# Altium schematic sheet Main_Board.SchDoc
size A3; SheetNumber: 1; SheetTotal: 4
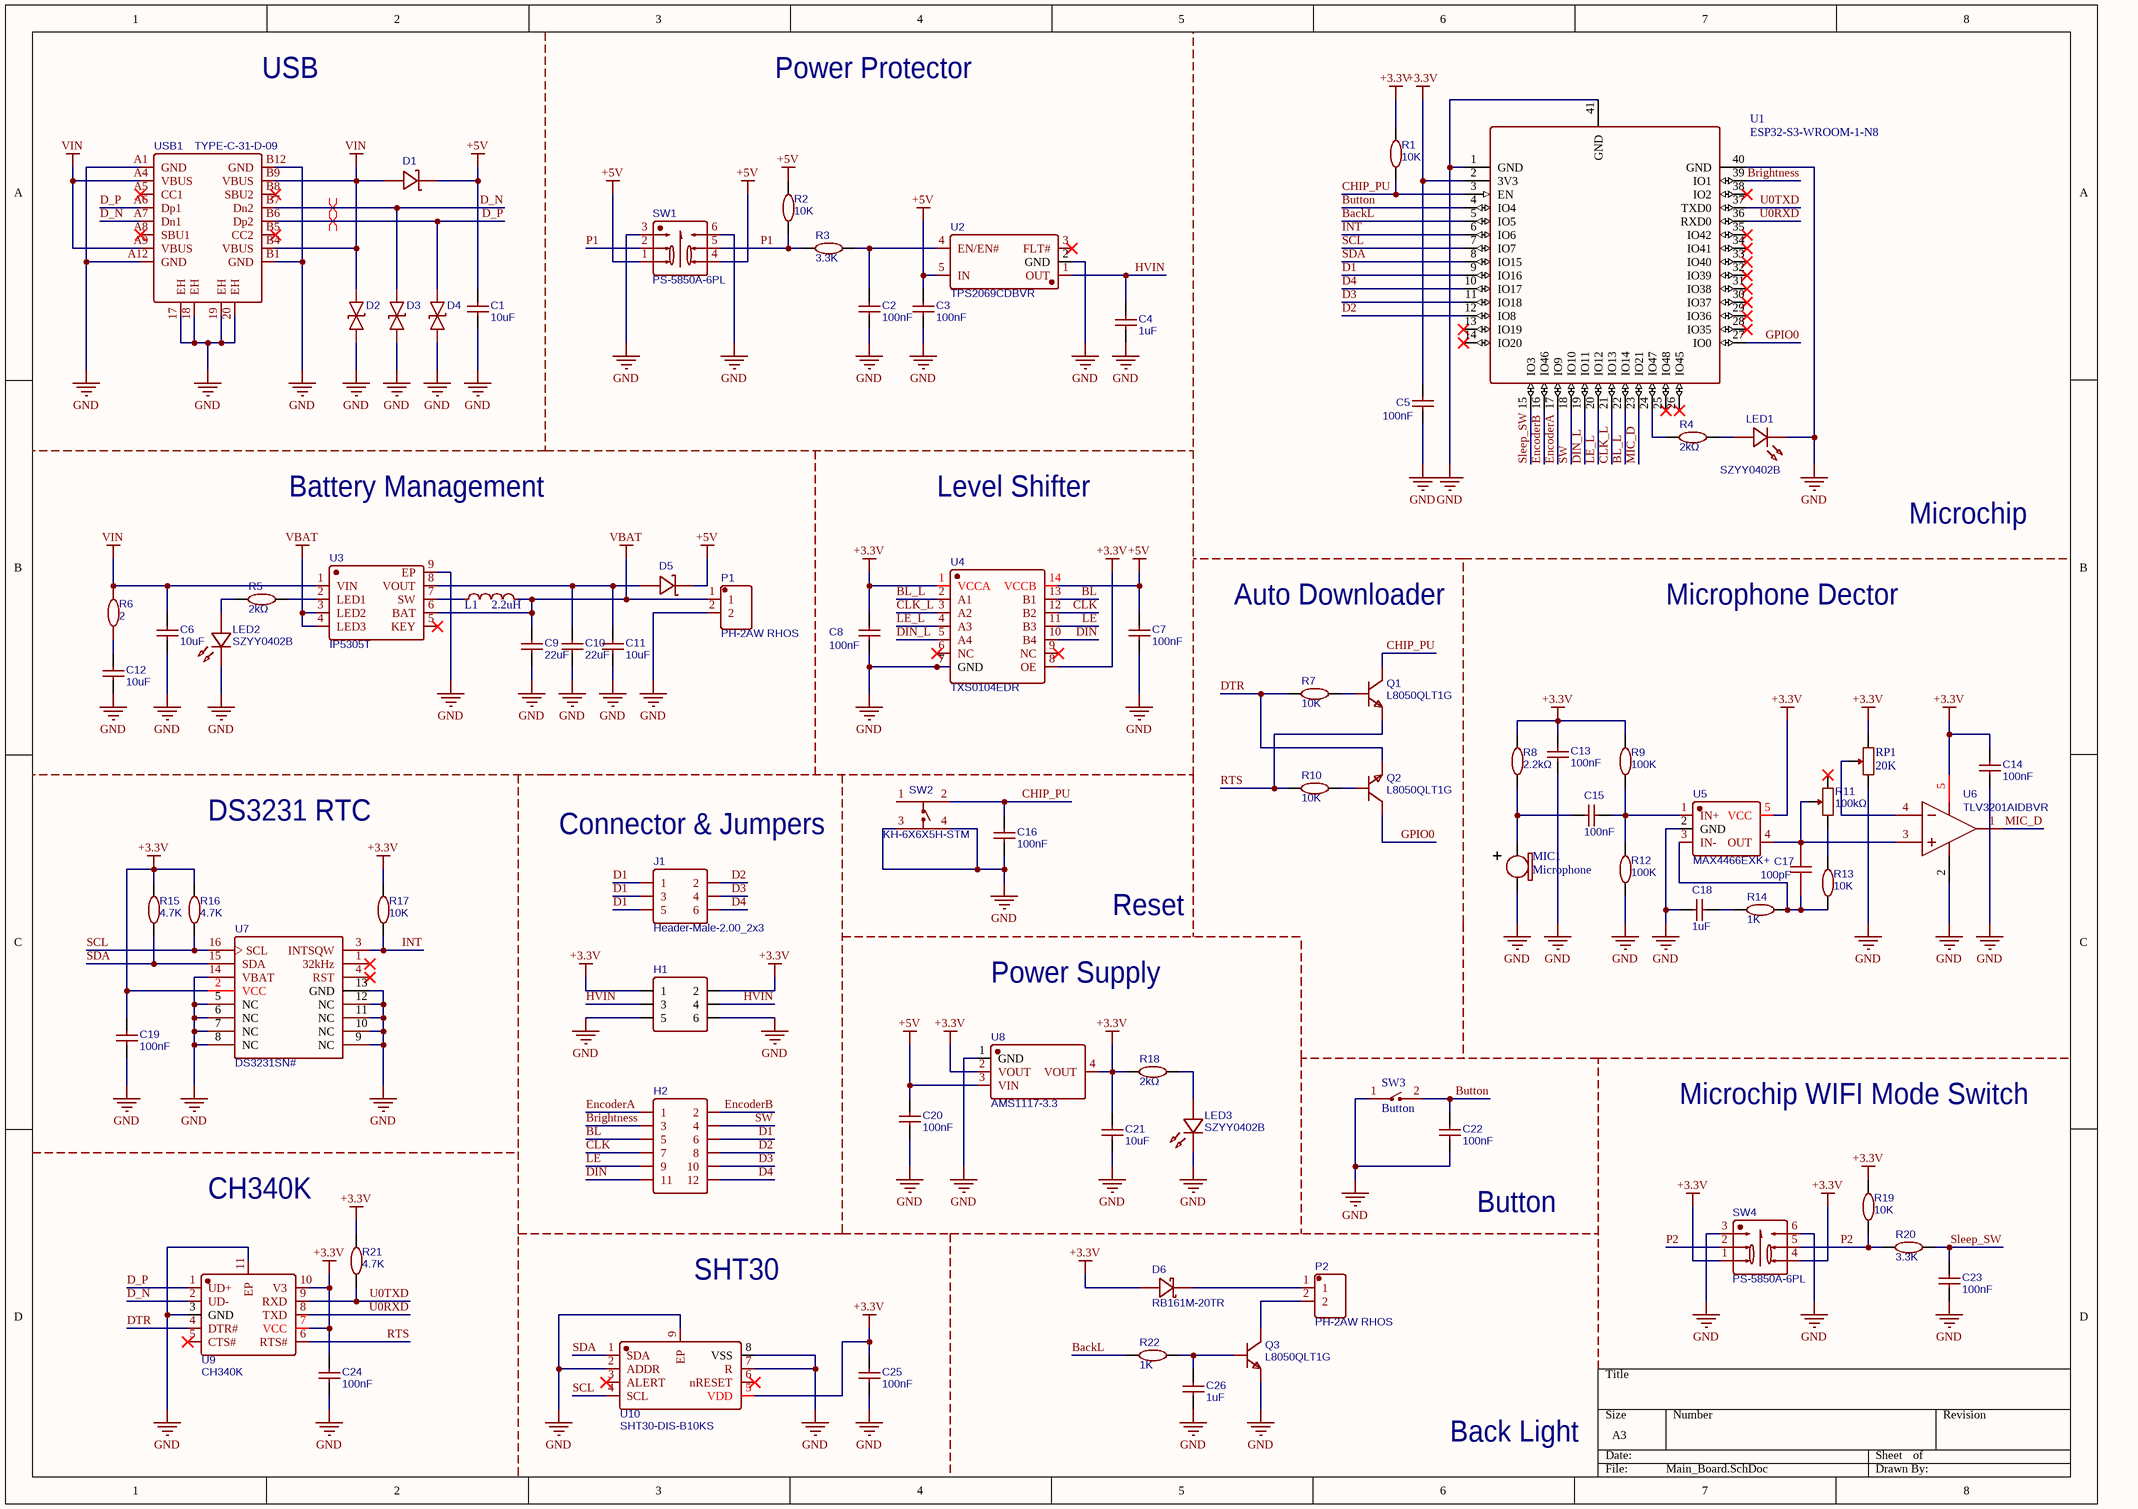
[diagram p0: Main_Board.SchDoc]

## Parts
C1  10uF  [C0805]
C2  100nF  [C0402_NEW]
C3  100nF  [C0402_NEW]
C4  1uF  [C0402]
C5  100nF  [C0402_NEW]
C6  10uF  [C0805]
C7  100nF  [C0402_NEW]
C8  100nF  [C0402_NEW]
C9  22uF  [C0805]
C10  22uF  [C0805]
C11  10uF  [C0805]
C12  10uF  [C0805]
C13  100nF  [C0402_NEW]
C14  100nF  [C0402_NEW]
C15  100nF  [C0402_NEW]
C16  100nF  [C0402_NEW]
C17  100pF  [C0402]
C18  1uF  [C0402]
C19  100nF  [C0402_NEW]
C20  100nF  [C0402_NEW]
C21  10uF  [C0805]
C22  100nF  [C0402_NEW]
C23  100nF  [C0402_NEW]
C24  100nF  [C0402_NEW]
C25  100nF  [C0402_NEW]
C26  1uF  [C0402]
D1  SS54_C22452  [SMA_L4.4-W2.8-LS5.4-R-RD]  (value not drawn)
D2  LESD5D5.0CT1G  [SOD-523_L1.2-W0.8-LS1.6-BI]  (value not drawn)
D3  LESD5D5.0CT1G  [SOD-523_L1.2-W0.8-LS1.6-BI]  (value not drawn)
D4  LESD5D5.0CT1G  [SOD-523_L1.2-W0.8-LS1.6-BI]  (value not drawn)
D5  SS54_C22452  [SMA_L4.4-W2.8-LS5.4-R-RD]  (value not drawn)
D6  RB161M-20TR  [SOD-123_L2.6-W1.6-LS3.5-RD-1]
H1  Header-Female-2.54_2x3  [HDR-TH_6P-P2.54-V-F-R2-C3-S2.54]  (value not drawn)
H2  Header-Female-2.54_2x6  [HDR-TH_12P-P2.54-V-F-R2-C6-S2.54]  (value not drawn)
J1  Header-Male-2.00_2x3  [HDR2.0-LI-2X3P]
L1  2.2uH  [L_2.2uH]
LED1  SZYY0402B  [LED0402-RD_BLUE]
LED2  SZYY0402B  [LED0402-RD_BLUE]
LED3  SZYY0402B  [LED0402-RD_BLUE]
MIC1  Microphone  [Microphone]
P1  PH-2AW RHOS  [CONN-TH_2P-P2.00_PH-2AW]
P2  PH-2AW RHOS  [CONN-TH_2P-P2.00_PH-2AW]
Q1  L8050QLT1G  [SOT-23-3_L2.9-W1.3-P1.90-LS2.4-BR]
Q2  L8050QLT1G  [SOT-23-3_L2.9-W1.3-P1.90-LS2.4-BR]
Q3  L8050QLT1G  [SOT-23-3_L2.9-W1.3-P1.90-LS2.4-BR]
R1  10K  [R0402]
R2  10K  [R0402]
R3  3.3K  [R0402]
R4  2kΩ  [R0402]
R5  2kΩ  [R0402]
R6  2  [R0603]
R7  10K  [R0402]
R8  2.2kΩ  [R0402]
R9  100K  [R0402]
R10  10K  [R0402]
R11  100kΩ  [RES-ADJ-SMD_VG039NCH]
R12  100K  [R0402]
R13  10K  [R0402]
R14  1K  [R0402]
R15  4.7K  [R0402]
R16  4.7K  [R0402]
R17  10K  [R0402]
R18  2kΩ  [R0402]
R19  10K  [R0402]
R20  3.3K  [R0402]
R21  4.7K  [R0402]
R22  1K  [R0402]
RP1  20K  [RES-ADJ-SMD_VG039NCH]
SW1  PS-5850A-6PL  [SW-TH_6P-L5.8-W5.8-P2.00-LS4.5-BL]
SW2  KH-6X6X5H-STM  [SW-SMD_4P-L6.0-W6.0-P4.50-LS9.0-2]
SW3  Button  [Button]
SW4  PS-5850A-6PL  [SW-TH_6P-L5.8-W5.8-P2.00-LS4.5-BL]
U1  ESP32-S3-WROOM-1-N8  [ESP32-S3-WROOM-1-N8_EXP]
U2  TPS2069CDBVR  [SOT-23-5_L3.0-W1.7-P0.95-LS2.8-BR]
U3  IP5305T  [ESOP-8_L4.9-W3.9-P1.27-LS6.0-BL-EP]
U4  TXS0104EDR  [SOIC-14_L8.7-W3.9-P1.27-LS6.0-BL]
U5  MAX4466EXK+  [SC-70-5_L2.0-W1.3-P0.65-LS2.2-BL]
U6  TLV3201AIDBVR  [SOT-23-5_L3.0-W1.7-P0.95-LS2.8-BR]
U7  DS3231SN#  [SOIC-16_L10.3-W7.5-P1.27-LS10.3-BL]
U8  AMS1117-3.3  [SOT-223-3_L6.5-W3.4-P2.30-LS7.0-BR]
U9  CH340K  [ESOP-10_L4.9-W3.9-P1.00-LS6.2-BL-EP]
U10  SHT30-DIS-B10KS  [DFN-8_L2.5-W2.5-P0.50-BL-EP]
USB1  TYPE-C-31-D-09  [USB-C-TH_TYPE-C-31-D-09]

## Nets
+3.3V: C5.2 C8.2 C13.2 C14.2 C19.2 C21.2 C24.2 C25.2 D6.2(A) H1.1 H1.2 R1.2 R8.2 R9.2 R15.2 R16.2 R17.2 R18.1 R19.2 R21.2 RP1.1 SW4.1 SW4.4 U1.2(3V3) U4.1(VCCA) U4.8(OE) U5.5(VCC) U6.5(VCC) U7.2(VCC) U8.2(VOUT) U8.4(VOUT) U9.7(VCC) U9.10(V3) U10.5(VDD)
+5V: C1.2 C3.2 C7.2 C20.2 D1.2(K) D5.2(K) R2.2 SW1.1 SW1.4 U2.5(IN) U4.14(VCCB) U8.3(VIN)
GND: C1.1 C2.1 C3.1 C4.1 C5.1 C6.1 C7.1 C8.1 C9.1 C10.1 C11.1 C12.1 C13.1 C14.1 C16.1 C18.1 C19.1 C20.1 C21.1 C22.1 C23.1 C24.1 C25.1 C26.1 D2.1 D3.1 D4.1 H1.5 H1.6 LED1.1(K) LED2.1(K) LED3.1(K) MIC1.2 P1.2 Q3.2(E) R12.1 RP1.3 SW1.3 SW1.6 SW2.3 SW2.4 SW3.1 SW4.3 SW4.6 U1.1(GND) U1.40(GND) U1.41(GND) U2.2(GND) U3.9(EP) U4.7(GND) U5.2(GND) U6.2(GND) U7.5(NC) U7.6(NC) U7.7(NC) U7.8(NC) U7.9(NC) U7.10(NC) U7.11(NC) U7.12(NC) U7.13(GND) U7.14(VBAT) U8.1(GND) U9.3(GND) U9.11(EP) U10.2(ADDR) U10.7(R) U10.8(VSS) U10.9(EP) USB1.17(EH) USB1.18(EH) USB1.19(EH) USB1.20(EH) USB1.A1(GND) USB1.A12(GND) USB1.B1(GND) USB1.B12(GND)
VBAT: C9.2 L1.2 P1.1 U3.3(LED2) U3.4(LED3) U3.6(BAT)
VIN: C6.2 D1.1(A) D2.2 R6.2 U3.1(VIN) USB1.A4(VBUS) USB1.A9(VBUS) USB1.B4(VBUS) USB1.B9(VBUS)
BackL: R22.1 U1.5(IO5)
BL: H2.5 U4.13(B1)
BL_L: U1.22(IO14) U4.2(A1)
Brightness: H2.3 U1.39(IO1)
Button: C22.2 SW3.2 U1.4(IO4)
CHIP_PU: C16.2 Q1.3(C) R1.1 SW2.2 U1.3(EN)
CLK: H2.7 U4.12(B2)
CLK_L: U1.21(IO13) U4.3(A2)
D1: H2.6 J1.1 J1.3 J1.5 U1.9(IO16)
D2: H2.8 J1.2 U1.12(IO8)
D3: H2.10 J1.4 U1.11(IO18)
D4: H2.12 J1.6 U1.10(IO17)
D_N: D3.2 U9.2(UD-) USB1.A7(Dn1) USB1.B7(Dn2)
D_P: D4.2 U9.1(UD+) USB1.A6(Dp1) USB1.B6(Dp2)
DIN: H2.11 U4.10(B4)
DIN_L: U1.19(IO11) U4.5(A4)
DTR: Q2.2(E) R7.1 U9.4(DTR#)
EncoderA: H2.1 U1.17(IO9)
EncoderB: H2.2 U1.16(IO46)
GPIO0: Q2.3(C) U1.27(IO0)
HVIN: C4.2 H1.3 H1.4 U2.1(OUT)
INT: R17.1 U1.6(IO6) U7.3(INTSQW)
LE: H2.9 U4.11(B3)
LE_L: U1.20(IO12) U4.4(A3)
MIC_D: U1.23(IO21) U6.1(OUT)
P1: R2.1 R3.2 SW1.2 SW1.5
P2: R19.1 R20.2 SW4.2 SW4.5
RTS: Q1.2(E) R10.1 U9.6(RTS#)
SCL: R16.1 U1.7(IO7) U7.16(SCL) U10.4(SCL)
SDA: R15.1 U1.8(IO15) U7.15(SDA) U10.1(SDA)
Sleep_SW: C23.2 R20.1 U1.15(IO3)
SW: H2.4 U1.18(IO10)
U0RXD: U1.36(RXD0) U9.8(TXD)
U0TXD: R21.1 U1.37(TXD0) U9.9(RXD)
NetC2_2: C2.2 R3.1 U2.4(EN/EN#)
NetC10_2: C10.2 C11.2 D5.1(A) U3.8(VOUT)
NetC12_2: C12.2 R6.1
NetC15_1: C15.1 R9.1 R12.2 U5.1(IN+)
NetC15_2: C15.2 MIC1.1 R8.1
NetC17_1: C17.1 R11.2 U5.4(OUT) U6.3(IN+)
NetC17_2: C17.2 R13.1 R14.2 U5.3(IN-)
NetC18_2: C18.2 R14.1
NetC26_2: C26.2 Q3.1(B) R22.2
NetD6_1: D6.1(K) P2.1
NetL1_1: L1.1 U3.7(SW)
NetLED1_2: LED1.2(A) R4.2
NetLED2_2: LED2.2(A) R5.1
NetLED3_2: LED3.2(A) R18.2
NetP2_2: P2.2 Q3.3(C)
NetQ1_1: Q1.1(B) R7.2
NetQ2_1: Q2.1(B) R10.2
NetR4_1: R4.1 U1.24(IO47)
NetR5_2: R5.2 U3.2(LED1)
NetR11_3: R11.3 R13.2
NetRP1_2: RP1.2 U6.4(IN-)

Not connected (* = marked no-connect by the designer): R11 1*; SW2 1; U1 13(IO19)* 14(IO20)* 25(IO48)* 26(IO45)* 28(IO35)* 29(IO36)* 30(IO37)* 31(IO38)* 32(IO39)* 33(IO40)* 34(IO41)* 35(IO42)* 38(IO2)*; U2 3(FLT#)*; U3 5(KEY)*; U4 6(NC)* 9(NC)*; U7 1(32kHz)* 4(RST)*; U9 5(CTS#)*; U10 3(ALERT)* 6(nRESET)*; USB1 A5(CC1)* A8(SBU1)* B5(CC2)* B8(SBU2)*

## Layout directives
differential pair: D_N, D_P

## Notes on the sheet
- USB
- Power Protector
- Battery Management
- Level Shifter
- Microchip
- Auto Downloader
- Microphone Dector
- DS3231 RTC
- Connector & Jumpers
- Reset
- Power Supply
- Microchip WIFI Mode Switch
- CH340K
- Button
- SHT30
- Back Light

## Library data of the parts
C1 C6 C11 C12 C21 = 10uF: BOM_Manufacturer Part: CL21A106KOQNNNE; BOM_Manufacturer: SAMSUNG(三星); nameAlias: Capacitance; BOM_Supplier: LCSC; BOM_Supplier Part: C1713; BOM_JLCPCB Part Class: Extended Part; spicePre: C; spiceSymbolName: CL21A106KOQNNNE
C2 C3 C5 C7 C8 C13-C16 C19 C20 C22-C25 = 100nF: BOM_Manufacturer Part: CL05B104KO5NNNC; BOM_Manufacturer: SAMSUNG(三星); nameAlias: Capacitance; BOM_Supplier: LCSC; BOM_Supplier Part: C1525; BOM_JLCPCB Part Class: Basic Part; spicePre: C; spiceSymbolName: CL05B104KO5NNNC
C4 C18 C26 = 1uF: BOM_Manufacturer Part: CL05A105KO5NNNC; BOM_Manufacturer: SAMSUNG(三星); nameAlias: Capacitance; BOM_Supplier: LCSC; BOM_Supplier Part: C29266; BOM_JLCPCB Part Class: Extended Part; spicePre: C; spiceSymbolName: CL05A105KO5NNNC
C9 C10 = 22uF: BOM_Manufacturer: SAMSUNG(三星); BOM_Manufacturer Part: CL21A226MOQNNNE; nameAlias: Capacitance; BOM_Supplier: LCSC; BOM_Supplier Part: C98190; BOM_JLCPCB Part Class: Extended Part; spicePre: C; spiceSymbolName: CL21A226MOQNNNE
C17 = 100pF: BOM_Manufacturer: YAGEO(国巨); BOM_Manufacturer Part: CC0402JRNPO9BN101; nameAlias: Capacitance; BOM_Supplier: LCSC; BOM_Supplier Part: C106200; BOM_JLCPCB Part Class: Extended Part; spicePre: C; spiceSymbolName: CC0603JRNPO9BN101
D1 D5 = SS54_C22452: BOM_Manufacturer Part: SS54; BOM_Manufacturer: MDD; BOM_Supplier: LCSC; BOM_Supplier Part: C22452; BOM_JLCPCB Part Class: Basic Part; spicePre: D; spiceSymbolName: SS54_C22452
D2-D4 = LESD5D5.0CT1G: BOM_Manufacturer: LRC(乐山无线电); Contributor: LCSC; BOM_Supplier: LCSC; BOM_Supplier Part: C383211; BOM_Manufacturer Part: LESD5D5.0CT1G; BOM_JLCPCB Part Class: Extended Part; spicePre: D; spiceSymbolName: LESD5D5.0CT1G
D6 = RB161M-20TR: BOM_Manufacturer: ROHM(罗姆); Contributor: LCSC; BOM_Supplier: LCSC; BOM_Supplier Part: C427072; BOM_Manufacturer Part: RB161M-20TR; BOM_JLCPCB Part Class: Extended Part; spicePre: D; spiceSymbolName: RB161M-20TR
H1 = Header-Female-2.54_2x3: BOM_Manufacturer: CONNFLY; BOM_Manufacturer Part: DS1023-2*3SF11; Contributor: LCSC; BOM_Supplier: LCSC; BOM_Supplier Part: C92272; BOM_JLCPCB Part Class: Extended Part; spicePre: H; spiceSymbolName: Header-Female-2.54_2x3
H2 = Header-Female-2.54_2x6: BOM_Manufacturer: BOOMELE(博穆精密); BOM_Manufacturer Part: 2.54-2*6P母; BOM_Supplier: LCSC; BOM_Supplier Part: C36191; BOM_JLCPCB Part Class: Extended Part; spicePre: H; spiceSymbolName: Header-Female-2.54_2x6
LED1-LED3 = SZYY0402B: BOM_Manufacturer: yongyu(永裕光电); Contributor: LCSC; BOM_Supplier: LCSC; BOM_Supplier Part: C434447; BOM_Manufacturer Part: SZYY0402B; BOM_JLCPCB Part Class: Extended Part; spicePre: L; spiceSymbolName: SZYY0402B
P1 P2 = PH-2AW RHOS: BOM_Manufacturer: BOOMELE; spicePre: X; BOM_Supplier: LCSC; BOM_Manufacturer Part: PH-2AW RHOS; BOM_Supplier Part: C16965; BOM_JLCPCB Part Class: Extended Part; spiceSymbolName: PH-2AW RHOS
Q1-Q3 = L8050QLT1G: BOM_Manufacturer: LRC(乐山无线电); BOM_Supplier: LCSC; BOM_Manufacturer Part: L8050QLT1G; BOM_Supplier Part: C49581; BOM_JLCPCB Part Class: Extended Part; spicePre: Q; spiceSymbolName: L8050QLT1G
R1 R2 R7 R10 R13 R17 R19 = 10K: BOM_Manufacturer: YAGEO(国巨); BOM_Manufacturer Part: RC0402FR-0710KL; nameAlias: Resistance (Ohms); Resistance: 10kΩ; BOM_Supplier: LCSC; BOM_Supplier Part: C60490; BOM_JLCPCB Part Class: Extended Part; spicePre: R; spiceSymbolName: RC0402FR-0710KL
R3 R20 = 3.3K: BOM_Manufacturer: YAGEO(国巨); BOM_Manufacturer Part: RC0402FR-073K3L; nameAlias: Resistance (Ohms); Resistance: 3.3kΩ; BOM_Supplier: LCSC; BOM_Supplier Part: C137992; BOM_JLCPCB Part Class: Extended Part; spicePre: R; spiceSymbolName: RC0402FR-073K3L
R4 R5 R8 R18 = 2kΩ: BOM_Manufacturer Part: 0402WGF2001TCE; BOM_Manufacturer: UNI-ROYAL(厚声); nameAlias: Resistance; Resistance (Ohms): 2K; BOM_Supplier: LCSC; BOM_Supplier Part: C4109; BOM_JLCPCB Part Class: Basic Part; spicePre: R; spiceSymbolName: 0402WGF2001TCE
R6 = 2: BOM_Manufacturer: YAGEO(国巨); BOM_Manufacturer Part: RC0603FR-072RL; nameAlias: Resistance (Ohms); Contributor: LCSC; Resistance: 2Ω; BOM_Supplier: LCSC; BOM_Supplier Part: C185341; BOM_JLCPCB Part Class: Extended Part; spicePre: R; spiceSymbolName: RC0603FR-072RL
R9 R12 = 100K: BOM_Manufacturer: YAGEO(国巨); BOM_Manufacturer Part: RC0402FR-07100KL; nameAlias: Resistance (Ohms); Resistance: 100kΩ; BOM_Supplier: LCSC; BOM_Supplier Part: C60491; BOM_JLCPCB Part Class: Extended Part; spicePre: R; spiceSymbolName: RC0402FR-07100KL
R11 = RP-VG039NCHXTB104: BOM_Manufacturer: HDK(北陆电气); nameAlias: Resistance; Contributor: LCSC; Resistance(Ohms): 100K; BOM_Supplier: LCSC; BOM_Manufacturer Part: VG039NCHXTB104; BOM_Supplier Part: C128545; Resistance (Ohms): 100K; BOM_JLCPCB Part Class: Extended Part; spicePre: R; spiceSymbolName: VG039NCHXTB104
R14 R22 = 1K: BOM_Manufacturer: YAGEO(国巨); BOM_Manufacturer Part: RC0402FR-071KL; nameAlias: Resistance (Ohms); Resistance: 1kΩ; BOM_Supplier: LCSC; BOM_Supplier Part: C106235; BOM_JLCPCB Part Class: Extended Part; spicePre: R; spiceSymbolName: RC0402FR-071KL
R15 R16 R21 = 4.7K: BOM_Manufacturer: YAGEO(国巨); BOM_Manufacturer Part: RC0402FR-074K7L; nameAlias: Resistance (Ohms); Resistance: 4.7kΩ; BOM_Supplier: LCSC; BOM_Supplier Part: C105871; BOM_JLCPCB Part Class: Extended Part; spicePre: R; spiceSymbolName: RC0402FR-074K7L
RP1 = RP-VG039NCHXTB203: BOM名称: 插件电位器; 版权归属: 源创客; 学习资源: www.ooocke.com
SW1 SW4 = PS-5850A-6PL: BOM_Manufacturer: G-Switch; Contributor: LCSC; BOM_Supplier: LCSC; BOM_Supplier Part: C963201; BOM_Manufacturer Part: PS-5850A-6PL; BOM_JLCPCB Part Class: Extended Part; spicePre: S; spiceSymbolName: PS-5850A-6PL
SW2 = KH-6X6X5H-STM: BOM_Manufacturer: kinghelm(金航标); Contributor: LCSC; BOM_Supplier: LCSC; BOM_Supplier Part: C2837531; BOM_Manufacturer Part: KH-6X6X5H-STM; BOM_JLCPCB Part Class: Extended Part; spicePre: S; spiceSymbolName: KH-6X6X5H-STM
U1 = ESP32-S3-WROOM-1-N8: Mfr_Name: Espressif Systems; Copyright: Copyright (C) 2023 Ultra Librarian. All rights reserved.; Manufacturer_Part_Number: ESP32-S3-WROOM-1-N8; RefDes: RefDes; Type: DEV
U2 = TPS2069CDBVR: BOM_Manufacturer: TI(德州仪器); Contributor: LCSC; BOM_Supplier: LCSC; BOM_Supplier Part: C181752; BOM_Manufacturer Part: TPS2069CDBVR; BOM_JLCPCB Part Class: Extended Part; spicePre: U; spiceSymbolName: TPS2069CDBVR
U3 = IP5305T: BOM_Manufacturer: INJOINIC(英集芯); Contributor: LCSC; BOM_Supplier: LCSC; BOM_Supplier Part: C2982924; BOM_Manufacturer Part: IP5305T; link: https://atta.szlcsc.com/upload/public/pdf/source/20220321/07FA860261DB7C99CD3F2F36D10D3B23.pdf; BOM_JLCPCB Part Class: Extended Part; spicePre: U; spiceSymbolName: IP5305T
U4 = TXS0104EDR: BOM_Manufacturer: TI(德州仪器); Contributor: LCSC; BOM_Supplier: LCSC; BOM_Manufacturer Part: TXS0104EDR; BOM_Supplier Part: C79342; BOM_JLCPCB Part Class: Extended Part; spicePre: U; spiceSymbolName: TXS0104EDR
U5 = MAX4466EXK+: BOM_Manufacturer: null; Contributor: LCSC; BOM_Supplier: LCSC; BOM_Supplier Part: C2892801; BOM_Manufacturer Part: MAX4466EXK+; BOM_JLCPCB Part Class: Extended Part; spicePre: U; spiceSymbolName: MAX4466EXK+
U6 = TLV3201AIDBVR: BOM_Manufacturer: TI(德州仪器); BOM_Supplier: LCSC; BOM_Manufacturer Part: TLV3201AIDBVR; BOM_Supplier Part: C105188; BOM_JLCPCB Part Class: Extended Part; spicePre: U; spiceSymbolName: TLV3201AIDBVR
U7 = DS3231SN#: BOM_Manufacturer: MAXIM(美信); BOM_Manufacturer Part: DS3231SN#T&R; subpart_no: 1; tags: Clock; BOM_Supplier Part: C9866; BOM_Supplier: LCSC; image: http://image.lceda.cn/szlcsc/C9866.jpg; BOM_JLCPCB Part Class: Extended Part; spicePre: U; spiceSymbolName: DS3231SN#
U8 = AMS1117-3.3: BOM_Manufacturer: AMS; sourceId: dwIGgezVh; timeStamp: 1476261164; BOM_Supplier: LCSC; BOM_Manufacturer Part: AMS1117-3.3; BOM_Supplier Part: C6186; BOM_JLCPCB Part Class: Basic Part; spicePre: U; spiceSymbolName: AMS1117-3.3
U9 = CH340K: BOM_Manufacturer: WCH(南京沁恒); Contributor: LCSC; BOM_Supplier: LCSC; BOM_Supplier Part: C968586; BOM_Manufacturer Part: CH340K; BOM_JLCPCB Part Class: Extended Part; spicePre: U; spiceSymbolName: CH340K
U10 = SHT30-DIS-B10KS: BOM_Manufacturer: Sensirion(瑞士盛思锐); Contributor: LCSC; BOM_Supplier: LCSC; BOM_Supplier Part: C2687423; BOM_Manufacturer Part: SHT30-DIS-B10KS; BOM_JLCPCB Part Class: Extended Part; spicePre: U; spiceSymbolName: SHT30-DIS-B10KS
USB1 = TYPE-C-31-D-09: BOM_Manufacturer: 韩国韩荣; Contributor: LCSC; BOM_Supplier: LCSC; BOM_Supplier Part: C2848615; BOM_Manufacturer Part: TYPE-C-31-D-09; BOM_JLCPCB Part Class: Extended Part; spicePre: U; spiceSymbolName: TYPE-C-31-D-09